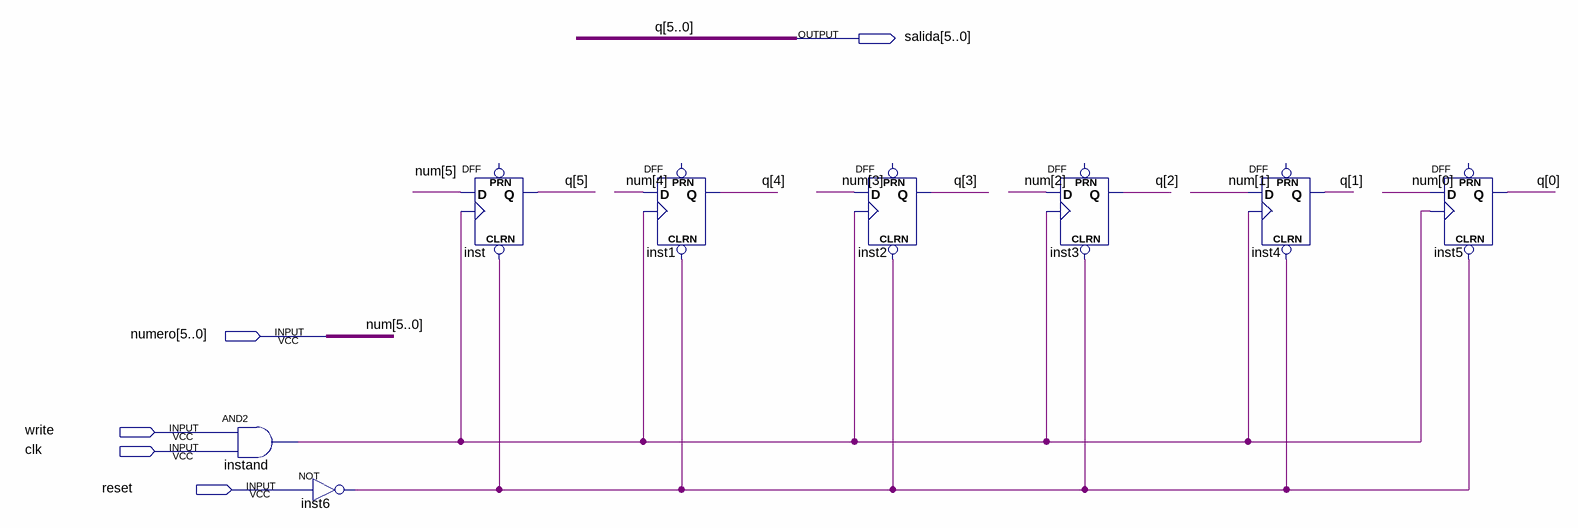
[diagram p0: schematic sheet]
// Quartus schematic recordador.bdf as structural Verilog: 8 symbols, 5 pins
module recordador (
  input  [5:0] numero,
  input  write,
  input  clk,
  input  reset,
  output [5:0] salida
);

  wire inst6_out, instand_out;

  and instand (instand_out, write, clk);
  not inst6 (inst6_out, reset);
  DFF inst (.CLRN(inst6_out), .CLK(instand_out), .D(numero[5]), .Q(salida[5]));  // open: PRN
  DFF inst1 (.CLRN(inst6_out), .CLK(instand_out), .D(numero[4]), .Q(salida[4]));  // open: PRN
  DFF inst2 (.CLRN(inst6_out), .CLK(instand_out), .D(numero[3]), .Q(salida[3]));  // open: PRN
  DFF inst3 (.CLRN(inst6_out), .CLK(instand_out), .D(numero[2]), .Q(salida[2]));  // open: PRN
  DFF inst4 (.CLRN(inst6_out), .CLK(instand_out), .D(numero[1]), .Q(salida[1]));  // open: PRN
  DFF inst5 (.CLRN(inst6_out), .CLK(instand_out), .D(numero[0]), .Q(salida[0]));  // open: PRN

  // Other names for the same wires on the sheet: num[5:0] = numero; q[5:0] = salida
endmodule
